# Altium schematic sheet AmplifierDclass_MCU.SchDoc
size 594 x 420 mm; DocumentNumber: Введите номер платы + Э3; SheetNumber: номер страницы; Format: A2
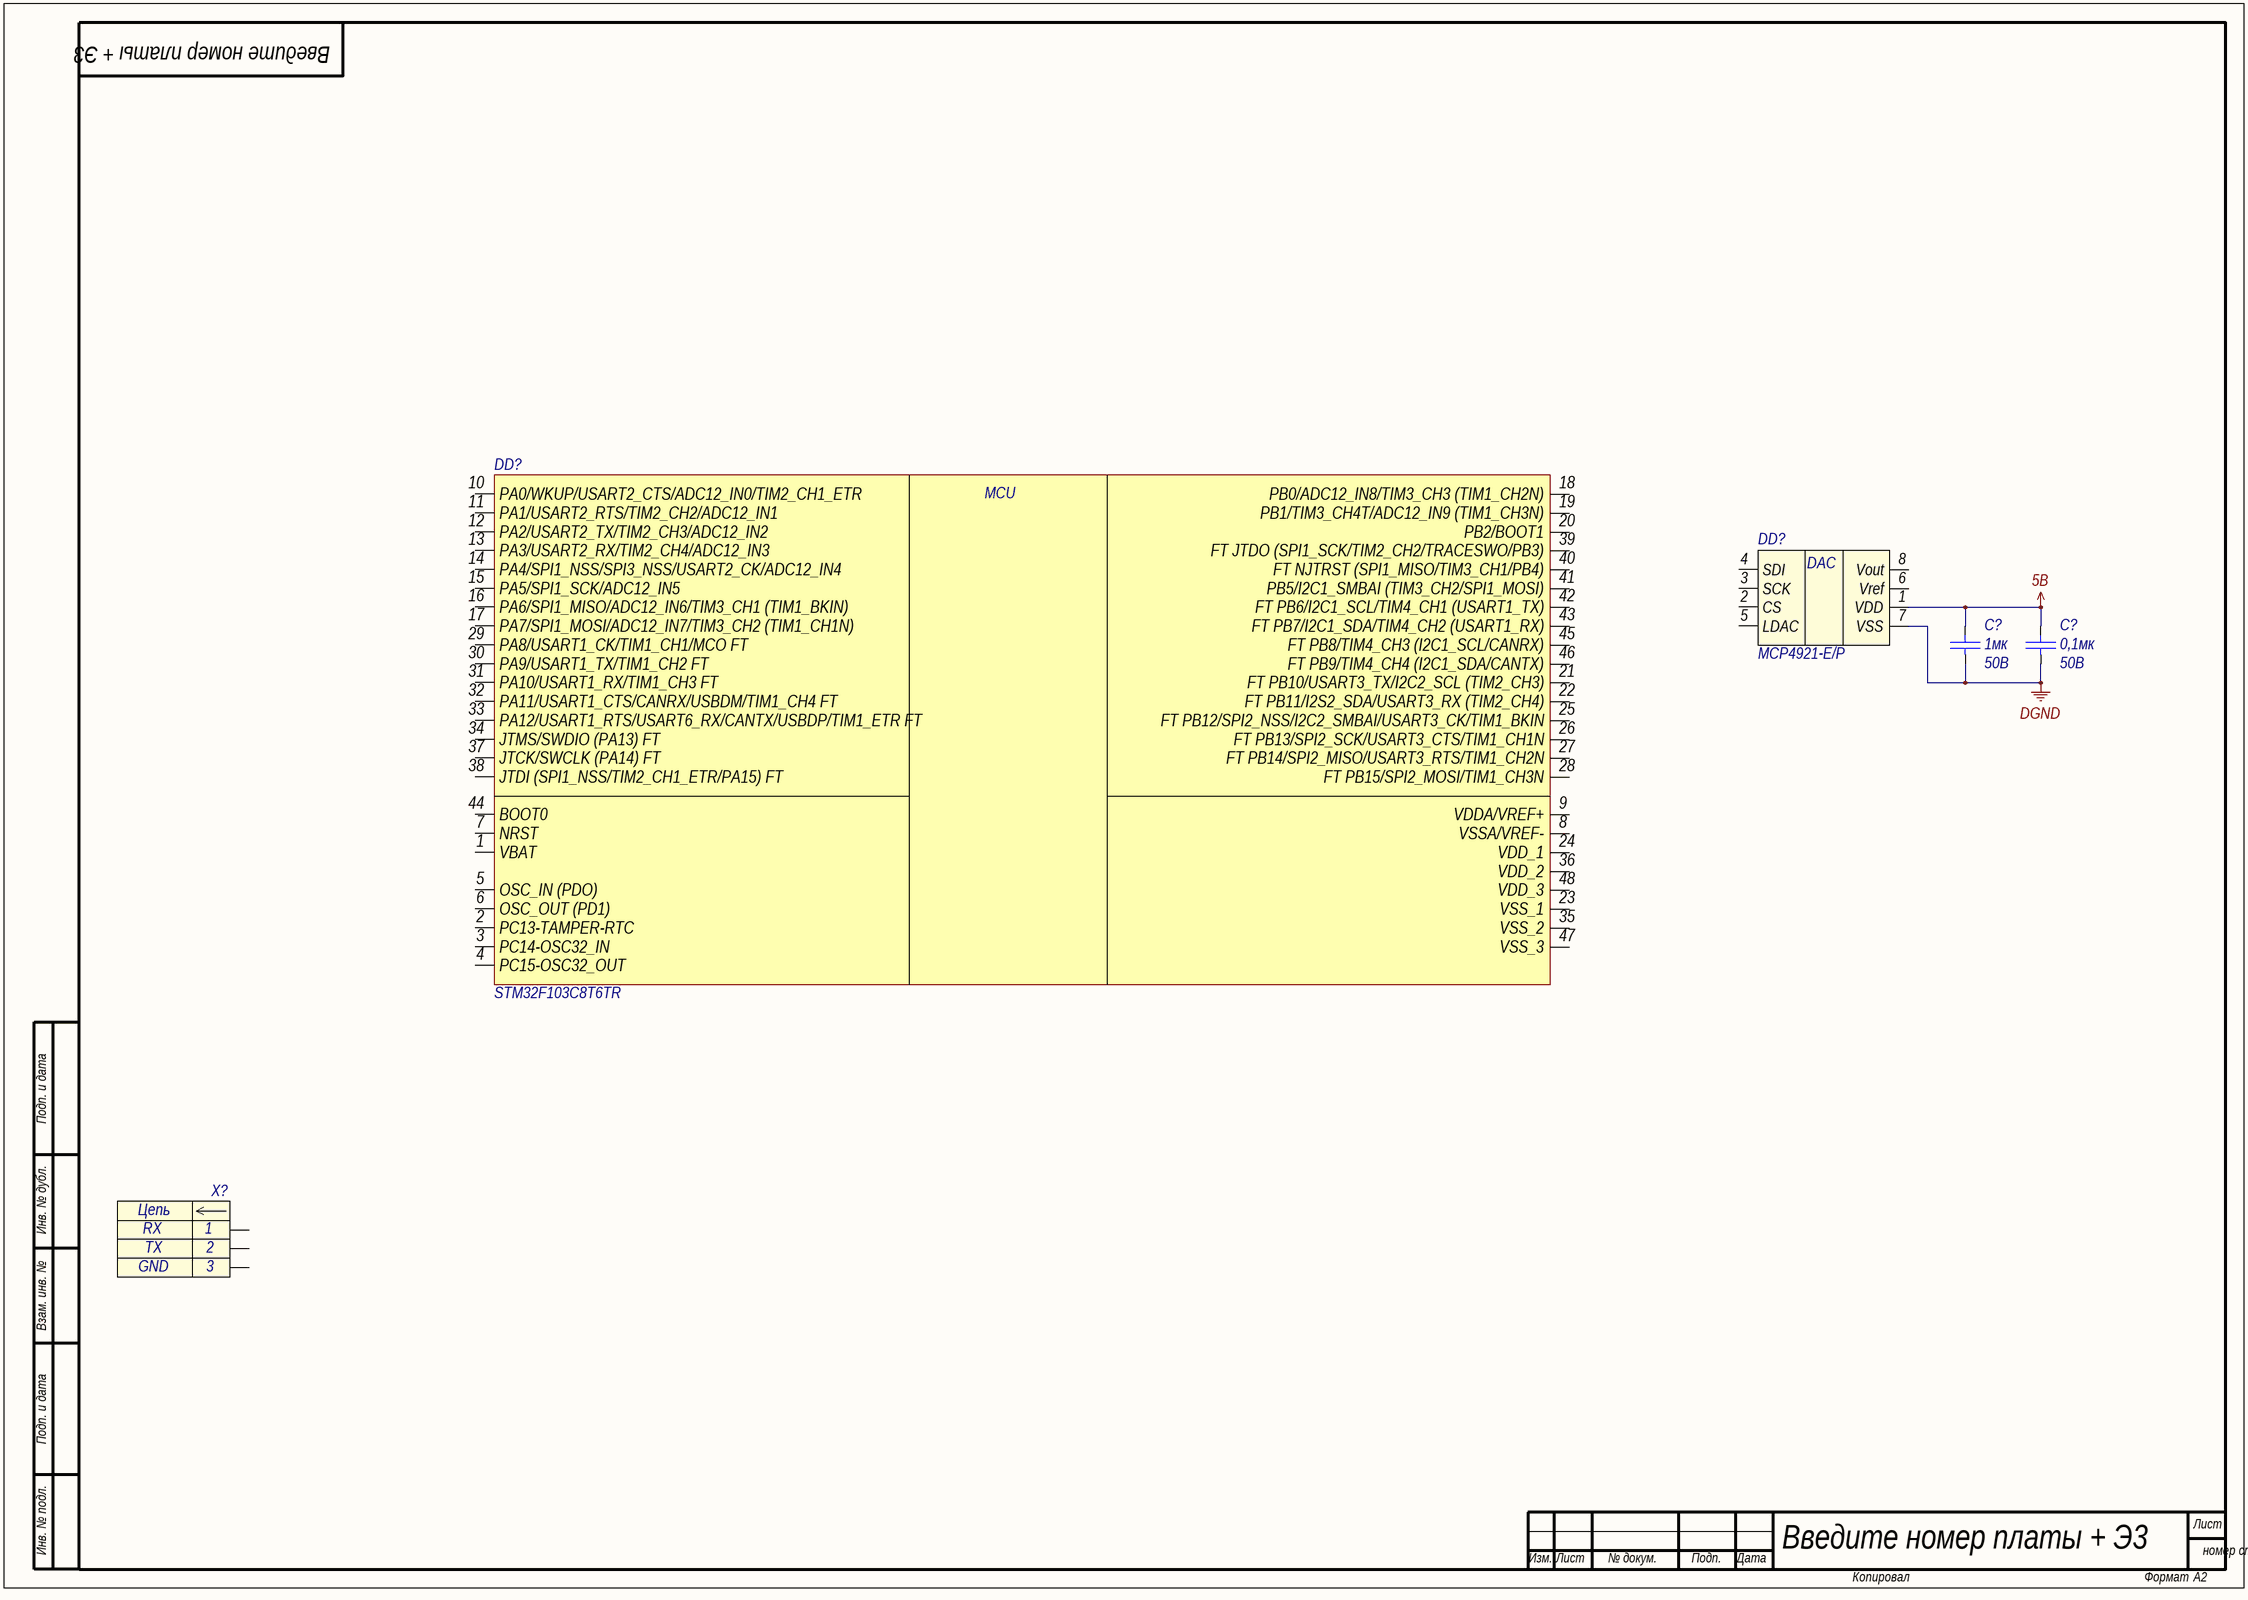
[diagram p0: AmplifierDclass_MCU.SchDoc]

## Parts
(Parts that share a designator on the sheet are numbered #1, #2 ... from top to bottom, then left to right.)
C?#1  value 1мк  Voltage: 50B  [C0805]  (hidden comment: Capacitor)
C?#2  value 0,1мк  Voltage: 50В  [C0805]  (hidden comment: Capacitor)
DD?#1  STM32F103C8T6TR  [LQFP48]
DD?#2  MCP4921-E/P  [SO8]
X?  Header_3_plg  [PLS-3]  (value not drawn)

## Nets
5B: C?#1.2 C?#2.2 DD?#2.1(VDD)
DGND: C?#1.1 C?#2.1 DD?#2.7(VSS)

Not connected (* = marked no-connect by the designer): DD?#1 1(VBAT) 2(PC13-TAMPER-RTC) 3(PC14-OSC32_IN) 4(PC15-OSC32_OUT) 5(OSC_IN_(PDO)) 6(OSC_OUT_(PD1)) 7(NRST) 8(VSSA/VREF-) 9(VDDA/VREF+) 10(PA0/WKUP/USART2_CTS/ADC12_IN0/TIM2_CH1_ETR) 11(PA1/USART2_RTS/TIM2_CH2/ADC12_IN1) 12(PA2/USART2_TX/TIM2_CH3/ADC12_IN2) 13(PA3/USART2_RX/TIM2_CH4/ADC12_IN3) 14(PA4/SPI1_NSS/SPI3_NSS/USART2_CK/ADC12_IN4) 15(PA5/SPI1_SCK/ADC12_IN5) 16(PA6/SPI1_MISO/ADC12_IN6/TIM3_CH1_(TIM1_BKIN)) 17(PA7/SPI1_MOSI/ADC12_IN7/TIM3_CH2_(TIM1_CH1N)) 18(PB0/ADC12_IN8/TIM3_CH3_(TIM1_CH2N)) 19(PB1/TIM3_CH4T/ADC12_IN9_(TIM1_CH3N)) 20(PB2/BOOT1) 21(FT_PB10/USART3_TX/I2C2_SCL_(TIM2_CH3)) 22(FT_PB11/I2S2_SDA/USART3_RX_(TIM2_CH4)) 23(VSS_1) 24(VDD_1) 25(FT_PB12/SPI2_NSS/I2C2_SMBAI/USART3_CK/TIM1_BKIN) 26(FT_PB13/SPI2_SCK/USART3_CTS/TIM1_CH1N) 27(FT_PB14/SPI2_MISO/USART3_RTS/TIM1_CH2N) 28(FT_PB15/SPI2_MOSI/TIM1_CH3N) 29(PA8/USART1_CK/TIM1_CH1/MCO_FT) 30(PA9/USART1_TX/TIM1_CH2_FT) 31(PA10/USART1_RX/TIM1_CH3_FT) 32(PA11/USART1_CTS/CANRX/USBDM/TIM1_CH4_FT) 33(PA12/USART1_RTS/USART6_RX/CANTX/USBDP/TIM1_ETR_FT) 34(JTMS/SWDIO_(PA13)_FT) 35(VSS_2) 36(VDD_2) 37(JTCK/SWCLK_(PA14)_FT) 38(JTDI_(SPI1_NSS/TIM2_CH1_ETR/PA15)_FT) 39(FT_JTDO_(SPI1_SCK/TIM2_CH2/TRACESWO/PB3)) 40(FT_NJTRST_(SPI1_MISO/TIM3_CH1/PB4)) 41(PB5/I2C1_SMBAI_(TIM3_CH2/SPI1_MOSI)) 42(FT_PB6/I2C1_SCL/TIM4_CH1_(USART1_TX)) 43(FT_PB7/I2C1_SDA/TIM4_CH2_(USART1_RX)) 44(BOOT0) 45(FT_PB8/TIM4_CH3_(I2C1_SCL/CANRX)) 46(FT_PB9/TIM4_CH4_(I2C1_SDA/CANTX)) 47(VSS_3) 48(VDD_3); DD?#2 2(CS) 3(SCK) 4(SDI) 5(LDAC) 6(Vref) 8(Vout); X? 1 2 3

## Notes on the sheet
- Подп. и дата
- Инв. № дубл.
- Взам. инв. №
- Инв. № подл.
- Лист
- Изм.
- № докум.
- Подп.
- Дата
- Копировал
- Формат
- (in symbol connect33) Цепь
- (in symbol interf10) DAC
- (in symbol microcont0) MСU

## Library data of the parts
C?#1 = cap151: Конденсатор; Part Name: Ceramic; Manufacture: Murata; Part Number: GRM21BR71H105K; id: cap151; TKE: X7R
C?#2 = cap160: Конденсатор; Part Name: Ceramic; Manufacture: Murata; Part Number: GRM21BR71H104KA01L; id: cap160; TKE: X7R
DD?#1 = microcont0: Medium-density performance line ARM®-based 32-bit MCU with 64  or 128 KB Flash, USB, CAN, 7 timers, 2 ADCs, 9 com. interfaces; Part Name: Microcontroller; Frequency: 72MHz; ADC: 10x12b; Interface: can, i2c, irda, lin, spi, uart, usb; Flash: 64kb; Pin in: 37; Power Supply: 2.0-3.6 V; id: microcont0; Part Number: STM32F103C8T6TR
DD?#2 = interf10: 12-Bit DAC with SPI™ Interface; Part Name: DAC - SPI Rail-to-Rail; Manufacture: Microchip; Resolution: 12bit; Number of Channel: 2; Vref output: yes; Type Supply: Single Polar; Power Supply: 2.7-5.5V; id: interf10; Part Number: MCP4921-E/P
X? = connect33: Разъем - 3 конт. вилка; Part Number: DS1021-1*3SF112-B; Manufacture: Ningbo connfly electronic; Contact_1: RX; Contact_2: TX; Contact_3: GND; Etch: 2,54mm; Part Name: PLS-3; id: connect33